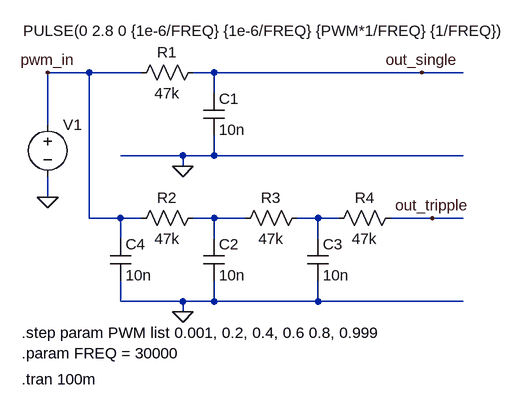
[diagram p0: schematic pwm_list.asc]
pwm_list.asc, the LTspice schematic file:
Version 4
SHEET 1 900 680
WIRE 112 64 48 64
WIRE 192 64 112 64
WIRE 304 64 272 64
WIRE 624 64 304 64
WIRE 688 64 624 64
WIRE 304 96 304 64
WIRE 48 144 48 64
WIRE 256 192 160 192
WIRE 304 192 304 160
WIRE 304 192 256 192
WIRE 688 192 304 192
WIRE 256 208 256 192
WIRE 48 256 48 224
WIRE 112 288 112 64
WIRE 160 288 112 288
WIRE 192 288 160 288
WIRE 304 288 272 288
WIRE 352 288 304 288
WIRE 464 288 432 288
WIRE 496 288 464 288
WIRE 640 288 576 288
WIRE 688 288 640 288
WIRE 160 320 160 288
WIRE 304 320 304 288
WIRE 464 320 464 288
WIRE 160 416 160 384
WIRE 256 416 160 416
WIRE 304 416 304 384
WIRE 304 416 256 416
WIRE 464 416 464 384
WIRE 464 416 304 416
WIRE 688 416 464 416
WIRE 256 432 256 416
FLAG 256 208 0
FLAG 256 432 0
FLAG 48 256 0
FLAG 624 64 out_single
FLAG 640 288 out_tripple
FLAG 48 64 pwm_in
SYMBOL voltage 48 128 R0
WINDOW 3 -38 -128 Left 2
WINDOW 123 0 0 Left 2
WINDOW 39 0 0 Left 2
SYMATTR Value PULSE(0 2.8 0 {1e-6/FREQ} {1e-6/FREQ} {PWM*1/FREQ} {1/FREQ})
SYMATTR InstName V1
SYMBOL res 288 48 R90
WINDOW 0 0 56 VBottom 2
WINDOW 3 32 56 VTop 2
SYMATTR InstName R1
SYMATTR Value 47k
SYMBOL cap 288 96 R0
SYMATTR InstName C1
SYMATTR Value 10n
SYMBOL res 288 272 R90
WINDOW 0 0 56 VBottom 2
WINDOW 3 32 56 VTop 2
SYMATTR InstName R2
SYMATTR Value 47k
SYMBOL cap 288 320 R0
SYMATTR InstName C2
SYMATTR Value 10n
SYMBOL res 448 272 R90
WINDOW 0 0 56 VBottom 2
WINDOW 3 32 56 VTop 2
SYMATTR InstName R3
SYMATTR Value 47k
SYMBOL cap 448 320 R0
SYMATTR InstName C3
SYMATTR Value 10n
SYMBOL res 592 272 R90
WINDOW 0 0 56 VBottom 2
WINDOW 3 32 56 VTop 2
SYMATTR InstName R4
SYMATTR Value 47k
SYMBOL cap 144 320 R0
SYMATTR InstName C4
SYMATTR Value 10n
TEXT 8 464 Left 2 !.step param PWM list 0.001, 0.2, 0.4, 0.6 0.8, 0.999
TEXT 8 496 Left 2 !.param FREQ = 30000
TEXT 8 536 Left 2 !.tran 100m

The netlist it stands for:
* pwm_list.asc
V1 pwm_in 0 PULSE(0 2.8 0 {1e-6/FREQ} {1e-6/FREQ} {PWM*1/FREQ} {1/FREQ})
R1 out_single pwm_in 47k
C1 out_single 0 10n
R2 N001 pwm_in 47k
C2 N001 0 10n
R3 N002 N001 47k
C3 N002 0 10n
R4 out_tripple N002 47k
C4 pwm_in 0 10n
.step param PWM list 0.001, 0.2, 0.4, 0.6 0.8, 0.999
.param FREQ = 30000
.tran 100m
.backanno
.end